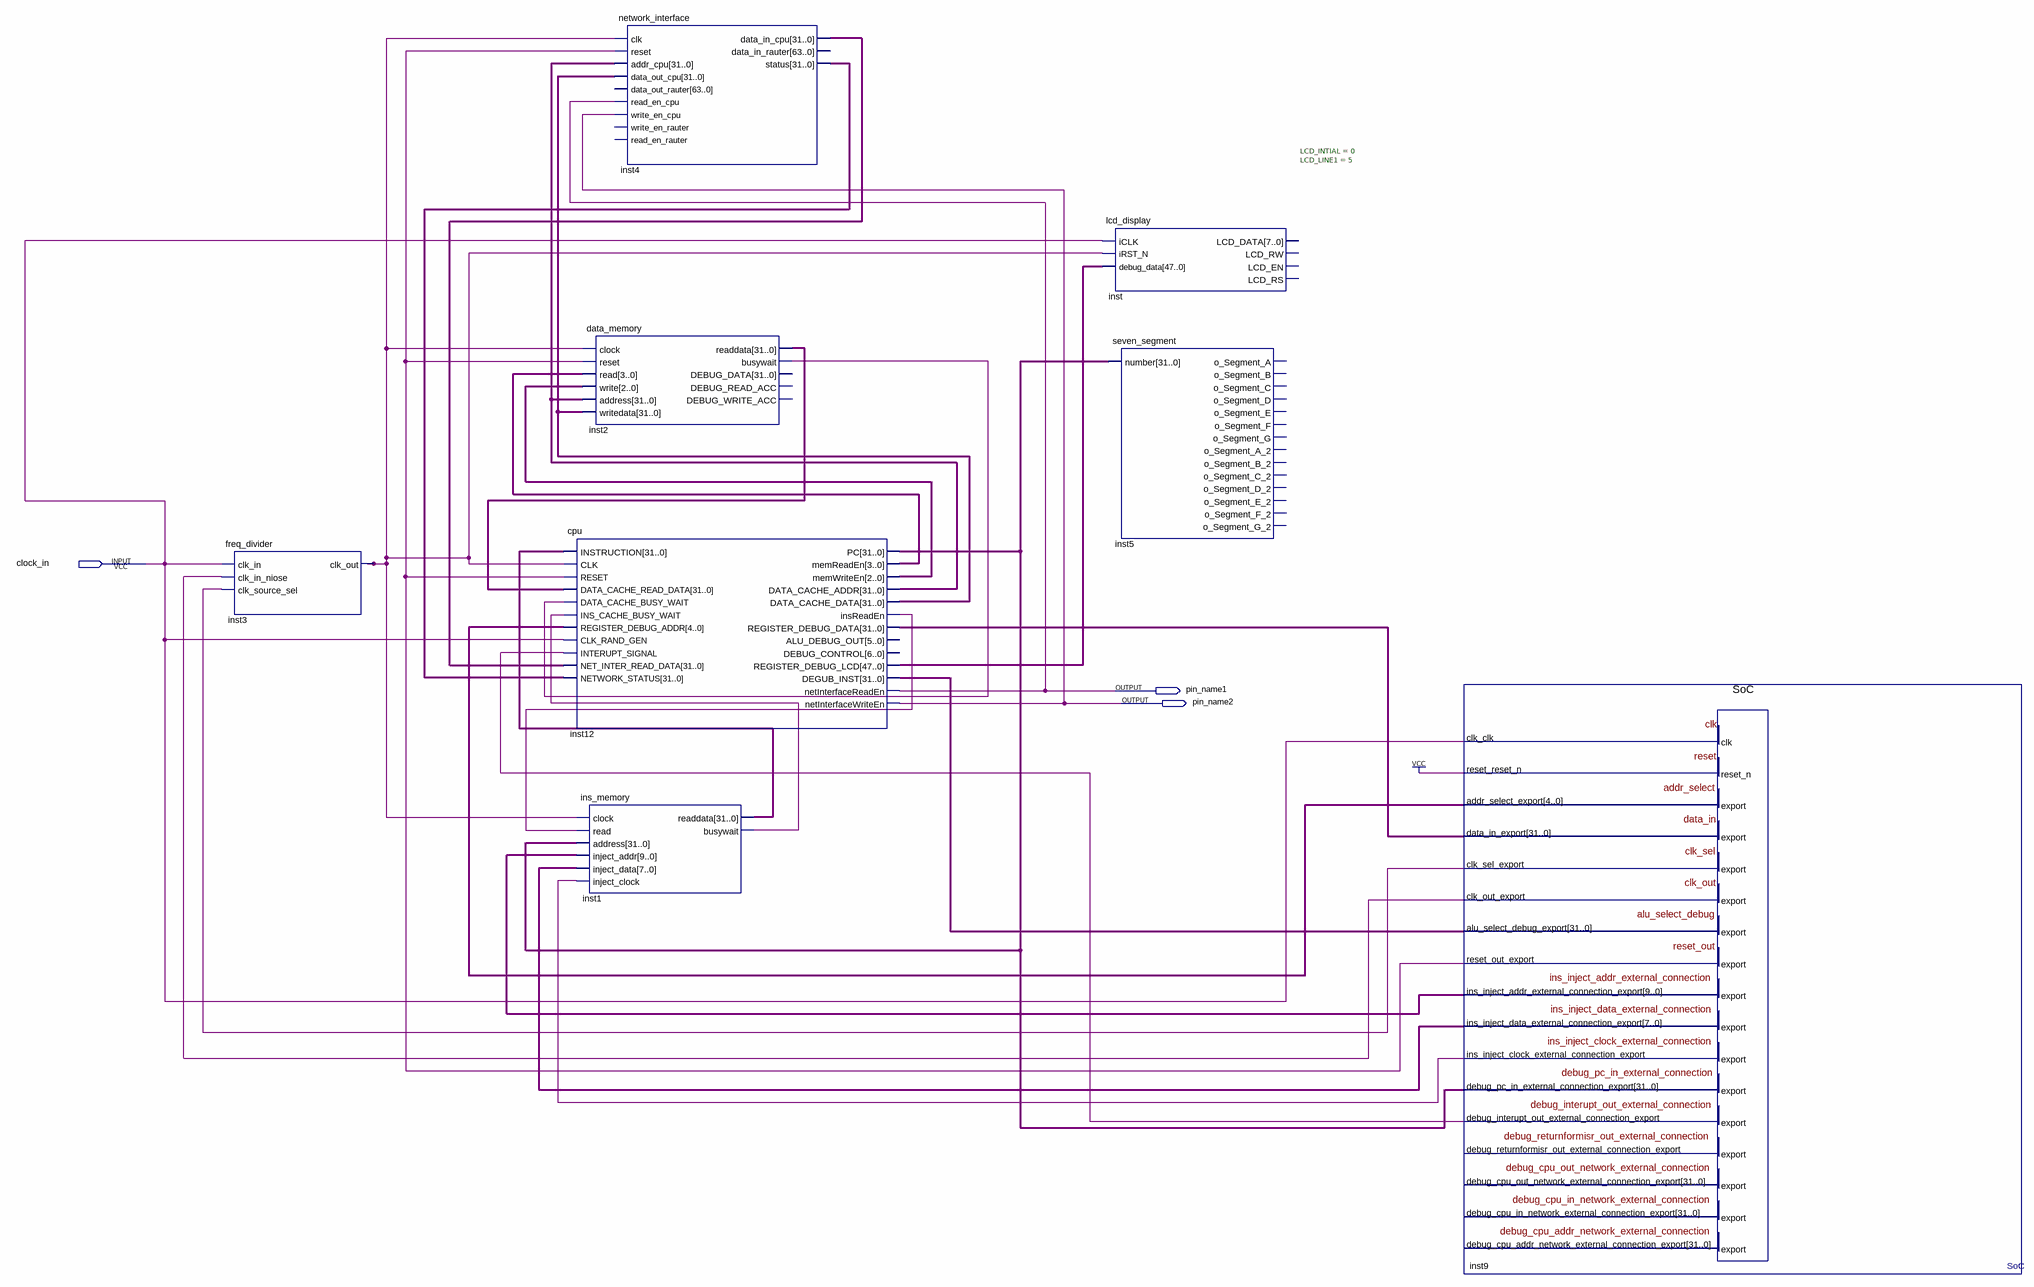
[diagram p0: schematic sheet]
// Quartus schematic system.bdf as structural Verilog: 8 symbols, 3 pins
module system (
  input  clock_in,
  output pin_name1,
  output pin_name2
);

  wire inst1_busywait, inst2_busywait, inst3_clk_out, inst9_clk_out_export, inst9_clk_sel_export,
       inst9_debug_interupt_out_external_connection_export,
       inst9_ins_inject_clock_external_connection_export, inst9_reset_out_export, inst12_insreaden;
  wire [2:0] inst12_memwriteen;
  wire [3:0] inst12_memreaden;
  wire [4:0] inst9_addr_select_export;
  wire [7:0] inst9_ins_inject_data_external_connection_export;
  wire [9:0] inst9_ins_inject_addr_external_connection_export;
  wire [31:0] inst1_readdata, inst2_readdata, inst4_data_in_cpu, inst4_status, inst12_data_cache_addr,
       inst12_data_cache_data, inst12_degub_inst, inst12_pc, inst12_register_debug_data;
  wire [47:0] inst12_register_debug_lcd;

  freq_divider inst3 (
    .clk_in(clock_in), .clk_in_niose(inst9_clk_out_export), .clk_source_sel(inst9_clk_sel_export),
    .clk_out(inst3_clk_out));
  data_memory inst2 (
    .clock(inst3_clk_out), .reset(inst9_reset_out_export), .read(inst12_memreaden),
    .write(inst12_memwriteen), .address(inst12_data_cache_addr), .writedata(inst12_data_cache_data),
    .readdata(inst2_readdata), .busywait(inst2_busywait));  // open: DEBUG_DATA, DEBUG_READ_ACC, DEBUG_WRITE_ACC
  cpu inst12 (
    .INSTRUCTION(inst1_readdata), .CLK(inst3_clk_out), .RESET(inst9_reset_out_export),
    .DATA_CACHE_READ_DATA(inst2_readdata), .DATA_CACHE_BUSY_WAIT(inst2_busywait),
    .INS_CACHE_BUSY_WAIT(inst1_busywait), .REGISTER_DEBUG_ADDR(inst9_addr_select_export),
    .CLK_RAND_GEN(clock_in), .INTERUPT_SIGNAL(inst9_debug_interupt_out_external_connection_export),
    .NET_INTER_READ_DATA(inst4_data_in_cpu), .NETWORK_STATUS(inst4_status), .PC(inst12_pc),
    .memReadEn(inst12_memreaden), .memWriteEn(inst12_memwriteen), .DATA_CACHE_ADDR(inst12_data_cache_addr),
    .DATA_CACHE_DATA(inst12_data_cache_data), .insReadEn(inst12_insreaden),
    .REGISTER_DEBUG_DATA(inst12_register_debug_data), .REGISTER_DEBUG_LCD(inst12_register_debug_lcd),
    .DEGUB_INST(inst12_degub_inst), .netInterfaceReadEn(pin_name1), .netInterfaceWriteEn(pin_name2));  // open: ALU_DEBUG_OUT, DEBUG_CONTROL
  ins_memory inst1 (
    .clock(inst3_clk_out), .read(inst12_insreaden), .address(inst12_pc),
    .inject_addr(inst9_ins_inject_addr_external_connection_export),
    .inject_data(inst9_ins_inject_data_external_connection_export),
    .inject_clock(inst9_ins_inject_clock_external_connection_export), .readdata(inst1_readdata),
    .busywait(inst1_busywait));
  network_interface inst4 (
    .clk(inst3_clk_out), .reset(inst9_reset_out_export), .addr_cpu(inst12_data_cache_addr),
    .data_out_cpu(inst12_data_cache_data), .read_en_cpu(pin_name1), .write_en_cpu(pin_name2),
    .data_in_cpu(inst4_data_in_cpu), .status(inst4_status));  // open: data_out_rauter, write_en_rauter, read_en_rauter, data_in_rauter
  lcd_display #(.LCD_INTIAL(0), .LCD_LINE1(5)) inst (
    .iCLK(clock_in), .iRST_N(inst3_clk_out), .debug_data(inst12_register_debug_lcd));  // open: LCD_DATA, LCD_RW, LCD_EN, LCD_RS
  seven_segment inst5 (.number(inst12_pc));  // open: o_Segment_A, o_Segment_B, o_Segment_C, o_Segment_D, o_Segment_E, o_Segment_F, o_Segment_G, o_Segment_A_2, o_Segment_B_2, o_Segment_C_2, o_Segment_D_2, o_Segment_E_2, o_Segment_F_2, o_Segment_G_2
  SoC inst9 (
    .clk_clk(clock_in), .reset_reset_n(1'b1), .data_in_export(inst12_register_debug_data),
    .alu_select_debug_export(inst12_degub_inst), .debug_pc_in_external_connection_export(inst12_pc),
    .addr_select_export(inst9_addr_select_export), .clk_sel_export(inst9_clk_sel_export),
    .clk_out_export(inst9_clk_out_export), .reset_out_export(inst9_reset_out_export),
    .ins_inject_addr_external_connection_export(inst9_ins_inject_addr_external_connection_export),
    .ins_inject_data_external_connection_export(inst9_ins_inject_data_external_connection_export),
    .ins_inject_clock_external_connection_export(inst9_ins_inject_clock_external_connection_export),
    .debug_interupt_out_external_connection_export(inst9_debug_interupt_out_external_connection_export));  // open: debug_cpu_out_network_external_connection_export, debug_returnformisr_out_external_connection_export, debug_cpu_in_network_external_connection_export, debug_cpu_addr_network_external_connection_export
endmodule
